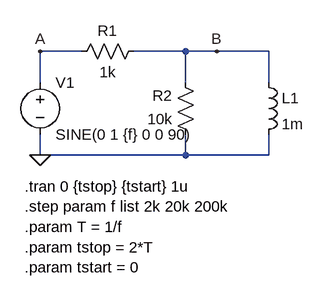
[diagram p0: schematic rl-circuit.asc]
rl-circuit.asc, the LTspice schematic file:
Version 4
SHEET 1 880 680
WIRE 112 80 48 80
WIRE 272 80 192 80
WIRE 320 80 272 80
WIRE 400 80 320 80
WIRE 48 128 48 80
WIRE 272 128 272 80
WIRE 400 128 400 80
WIRE 48 240 48 208
WIRE 272 240 272 208
WIRE 272 240 48 240
WIRE 400 240 400 208
WIRE 400 240 272 240
FLAG 48 240 0
FLAG 48 80 A
FLAG 320 80 B
SYMBOL voltage 48 112 R0
WINDOW 123 0 0 Left 0
WINDOW 39 0 0 Left 0
SYMATTR InstName V1
SYMATTR Value SINE(0 1 {f} 0 0 90)
SYMBOL res 208 64 R90
WINDOW 0 0 56 VBottom 2
WINDOW 3 32 56 VTop 2
SYMATTR InstName R1
SYMATTR Value 1k
SYMBOL res 288 224 R180
WINDOW 0 36 76 Left 2
WINDOW 3 36 40 Left 2
SYMATTR InstName R2
SYMATTR Value 10k
SYMBOL ind 384 112 R0
SYMATTR InstName L1
SYMATTR Value 1m
TEXT 24 288 Left 2 !.tran 0 {tstop} {tstart} 1u\n.step param f list 2k 20k 200k\n.param T = 1/f\n.param tstop = 2*T\n.param tstart = 0

The netlist it stands for:
* rl-circuit.asc
V1 A 0 SINE(0 1 {f} 0 0 90)
R1 B A 1k
R2 0 B 10k
L1 B 0 1m
.tran 0 {tstop} {tstart} 1u
.step param f list 2k 20k 200k
.param T = 1/f
.param tstop = 2*T
.param tstart = 0
.backanno
.end